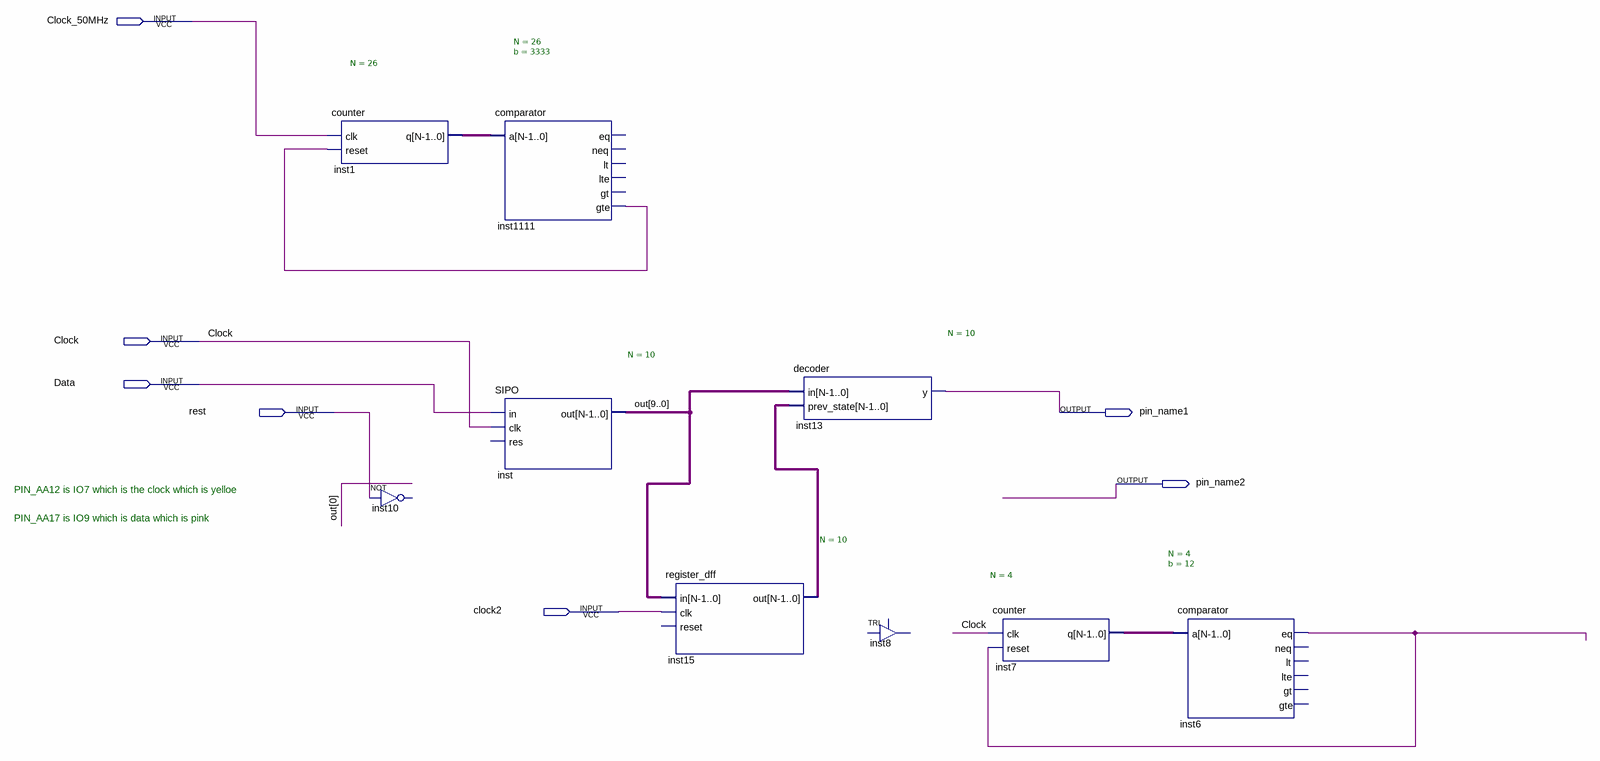
[diagram p0: schematic sheet]
// Quartus schematic Top_Level.bdf as structural Verilog: 9 symbols, 7 pins
module Top_Level (
  input  Clock_50MHz,
  input  Clock,
  input  Data,
  input  rest,
  input  clock2,
  output pin_name1,
  output pin_name2
);

  wire inst6_eq, inst1111_gte;
  wire [3:0] inst7_q;
  wire [9:0] inst15_out, out;
  wire [25:0] inst1_q;

  counter #(.N(26)) inst1 (.clk(Clock_50MHz), .reset(inst1111_gte), .q(inst1_q));
  // NOT inst10 has open pins: IN=rest, OUT=open
  comparator #(.N(26), .b(3333)) inst1111 (.a(inst1_q), .gte(inst1111_gte));  // open: eq, neq, lt, lte, gt
  SIPO #(.N(10)) inst (.in(Data), .clk(Clock), .out(out));  // open: res
  register_dff #(.N(10)) inst15 (.in(out), .clk(clock2), .out(inst15_out));  // open: reset
  decoder #(.N(10)) inst13 (.in(out), .prev_state(inst15_out), .y(pin_name1));
  TRI inst8 ();  // open: IN, OE, OUT
  counter #(.N(4)) inst7 (.clk(Clock), .reset(inst6_eq), .q(inst7_q));
  comparator #(.N(4), .b(12)) inst6 (.a(inst7_q), .eq(inst6_eq));  // open: neq, lt, lte, gt, gte

  // Notes on the sheet:
  //   PIN_AA12 is IO7 which is the clock which is yelloe 
  //   PIN_AA17 is IO9 which is data which is pink
endmodule
